# Altium schematic sheet Sheet1.SchDoc
size A4
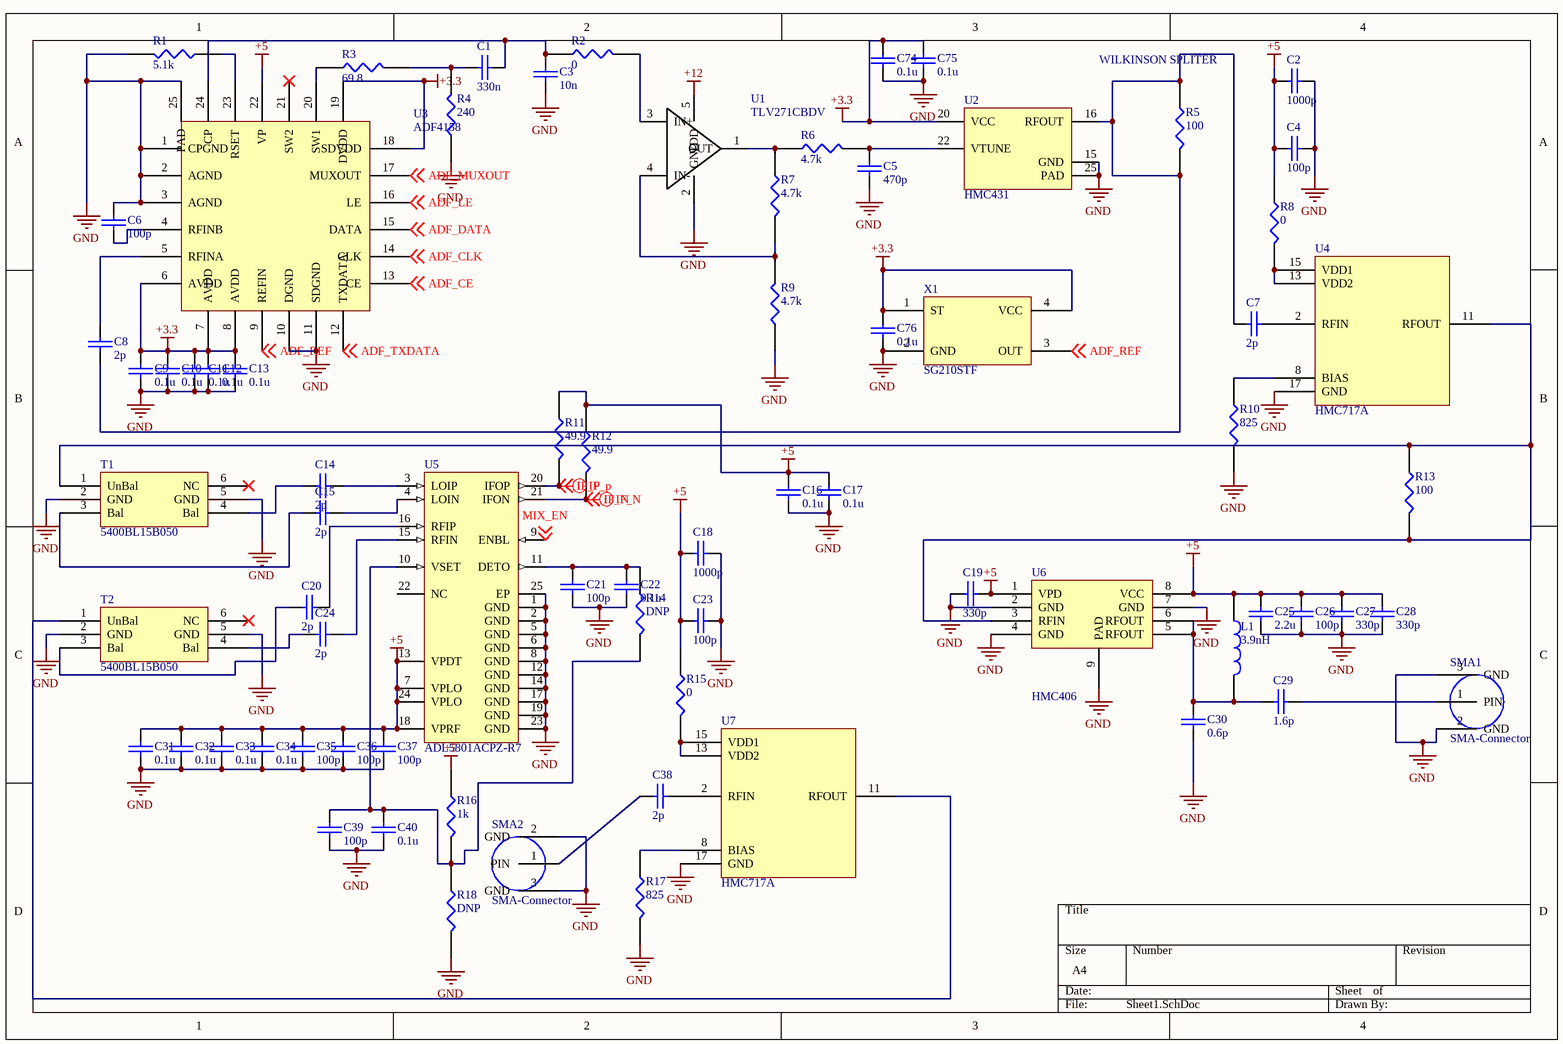
[diagram p0: Sheet1.SchDoc]

## Parts
C1  330n  [0603_R]
C2  1000p  [0603_R]
C3  10n  [0603_R]
C4  100p  [0603_R]
C5  470p  [0603_R]
C6  100p  [0603_R]
C7  2p  [0603_R]
C8  2p  [0603_R]
C9  0.1u  [0603_R]
C10  0.1u  [0603_R]
C11  0.1u  [0603_R]
C12  0.1u  [0603_R]
C13  0.1u  [0603_R]
C14  2p  [0603_R]
C15  2p  [0603_R]
C16  0.1u  [0603_R]
C17  0.1u  [0603_R]
C18  1000p  [0603_R]
C19  330p  [0603_R]
C20  2p  [0603_R]
C21  100p  [0603_R]
C22  0.1u  [0603_R]
C23  100p  [0603_R]
C24  2p  [0603_R]
C25  2.2u  [0603_R]
C26  100p  [0603_R]
C27  330p  [0603_R]
C28  330p  [0603_R]
C29  1.6p  [0603_R]
C30  0.6p  [0603_R]
C31  0.1u  [0603_R]
C32  0.1u  [0603_R]
C33  0.1u  [0603_R]
C34  0.1u  [0603_R]
C35  100p  [0603_R]
C36  100p  [0603_R]
C37  100p  [0603_R]
C38  2p  [0603_R]
C39  100p  [0603_R]
C40  0.1u  [0603_R]
C74  0.1u  [0603_R]
C75  0.1u  [0603_R]
C76  0.1u  [0603_R]
L1  3.9nH  [0603_R]
R1  5.1k  [0603_R]
R2  0  [0603_R]
R3  69.8  [0603_R]
R4  240  [0603_R]
R5  100  [0603_R]
R6  4.7k  [0603_R]
R7  4.7k  [0603_R]
R8  0  [0603_R]
R9  4.7k  [0603_R]
R10  825  [0603_R]
R11  49.9  [0603_R]
R12  49.9  [0603_R]
R13  100  [0603_R]
R14  DNP  [0603_R]
R15  0  [0603_R]
R16  1k  [0603_R]
R17  825  [0603_R]
R18  DNP  [0603_R]
SMA1  SMA-Connector  [SMA-2]
SMA2  SMA-Connector  [SMA-2]
T1  5400BL15B050  [0603-6]
T2  5400BL15B050  [0603-6]
U1  TLV271CBDV  [LT-S5-5-TSOT-23_L]
U2  HMC431  [LCC24-HMC431]
U3  ADF4158  [LCC24_ADF4158]
U4  HMC717A  [LCC16-717A]
U5  ADL5801ACPZ-R7  [ADI-CP-24-3_N]
U6  HMC406
U7  HMC717A  [LCC16-717A]
X1  SG210STF  [SG210STF]

## Nets
+3.3: C9.1 C10.1 C11.1 C12.1 C13.1 C74.2 C75.2 C76.1 U2.20(VCC) U3.6(AVDD) U3.7(AVDD) U3.8(AVDD) U3.18(SDVDD) U3.19(DVDD) X1.1(ST) X1.4(VCC)
+5: C2.1 C4.1 C16.2 C17.2 C18.1 C19.1 C23.1 C25.2 C26.2 C27.2 C28.2 C31.2 C32.2 C33.2 C34.2 C35.2 C36.2 C37.2 L1.1 R8.1 R11.1 R12.1 R15.1 R16.1 U3.22(VP) U5.7(VPLO) U5.13(VPDT) U5.18(VPRF) U5.24(VPLO) U6.1(VPD) U6.8(VCC)
+12: U1.5(VDD)
GND: C2.2 C3.2 C4.2 C5.2 C6.1 C9.2 C10.2 C11.2 C12.2 C13.2 C16.1 C17.1 C18.2 C19.2 C21.1 C22.1 C23.2 C25.1 C26.1 C27.1 C28.1 C30.1 C31.1 C32.1 C33.1 C34.1 C35.1 C36.1 C37.1 C39.1 C40.1 C74.1 C75.1 C76.2 R1.2 R4.1 R9.1 R10.2 R17.2 R18.2 SMA1.2(GND) SMA1.3(GND) SMA2.2(GND) SMA2.3(GND) T1.2(GND) T1.5(GND) T2.2(GND) T2.5(GND) U1.2(GND) U2.15(GND) U2.25(PAD) U3.1(CPGND) U3.2(AGND) U3.3(AGND) U3.10(DGND) U3.11(SDGND) U3.25(PAD) U4.17(GND) U5.1(GND) U5.2(GND) U5.5(GND) U5.6(GND) U5.8(GND) U5.12(GND) U5.14(GND) U5.17(GND) U5.19(GND) U5.23(GND) U5.25(EP) U6.2(GND) U6.4(GND) U6.7(GND) U6.9(PAD) U7.17(GND) X1.2(GND)
ADF_CE: U3.13(CE) ; off-sheet ADF_CE
ADF_CLK: U3.14(CLK) ; off-sheet ADF_CLK
ADF_DATA: U3.15(DATA) ; off-sheet ADF_DATA
ADF_LE: U3.16(LE) ; off-sheet ADF_LE
ADF_MUXOUT: U3.17(MUXOUT) ; off-sheet ADF_MUXOUT
ADF_REF: U3.9(REFIN) X1.3(OUT) ; off-sheet ADF_REF
ADF_TXDATA: U3.12(TXDATA) ; off-sheet ADF_TXDATA
IF_N: R12.2 U5.21(IFON) ; off-sheet IF_N
IF_P: R11.2 U5.20(IFOP) ; off-sheet IF_P
MIX_EN: U5.9(ENBL) ; off-sheet MIX_EN
NetC1_1: C1.1 R3.2 R4.2
NetC1_2: C1.2 C3.1 R2.1 U3.24(CP)
NetC5_1: C5.1 R6.2 U2.22(VTUNE)
NetC6_2: C6.2 U3.4(RFINB)
NetC7_1: C7.1 C8.2 R5.1 R5.2 U2.16(RFOUT)
NetC7_2: C7.2 U4.2(RFIN)
NetC8_1: C8.1 U3.5(RFINA)
NetC14_1: C14.1 T1.4(Bal)
NetC14_2: C14.2 U5.3(LOIP)
NetC15_1: C15.1 T1.3(Bal)
NetC15_2: C15.2 U5.4(LOIN)
NetC20_1: C20.1 T2.3(Bal)
NetC20_2: C20.2 U5.16(RFIP)
NetC21_2: C21.2 C22.2 R14.1 U5.11(DETO)
NetC24_1: C24.1 T2.4(Bal)
NetC24_2: C24.2 U5.15(RFIN)
NetC29_1: C29.1 SMA1.1(PIN)
NetC29_2: C29.2 C30.2 L1.2 U6.5(RFOUT) U6.6(RFOUT)
NetC38_1: C38.1 SMA2.1(PIN)
NetC38_2: C38.2 U7.2(RFIN)
NetC39_2: C39.2 C40.2 R14.2 R16.2 R18.1 U5.10(VSET)
NetR1_1: R1.1 U3.23(RSET)
NetR2_2: R2.2 U1.3(IN+)
NetR3_1: R3.1 U3.20(SW1)
NetR6_1: R6.1 R7.1 U1.1(OUT)
NetR7_2: R7.2 R9.2 U1.4(IN-)
NetR8_2: R8.2 U4.13(VDD2) U4.15(VDD1)
NetR10_1: R10.1 U4.8(BIAS)
NetR13_1: R13.1 R13.2 T1.1(UnBal) U4.11(RFOUT) U6.3(RFIN)
NetR15_2: R15.2 U7.13(VDD2) U7.15(VDD1)
NetR17_1: R17.1 U7.8(BIAS)
NetT2_1: T2.1(UnBal) U7.11(RFOUT)

Not connected (* = marked no-connect by the designer): T1 6(NC)*; T2 6(NC)*; U3 21(SW2)*; U5 22(NC)

## Layout directives
differential pair: IF_N, IF_P

## Notes on the sheet
- WILKINSON SPLITER

## Library data of the parts
C1-C40 C74-C76 = CAP: Capacitor
L1 = INDUCTOR
R1-R18 = RES1
U3 = ADF4518
U5 = ADL5801ACPZ-R7: High IP3, 10 MHz to 6 GHz, Active Mixer, 130mA Supply Current, CP-24-3, Pb-Free, 1500 Reel; RF Frequency (MHZ): 10 to 6000; IF Frequency (MHz): LF to 3000; Conversion Gain (dB): 1.8dB; IP3 (dBm): 28.5; P1dB (dBm): 13.3; NF (dB): 9.75dB; DatasheetVersion: Rev. A; PackageVersion: Jan-2005; PackageReference: CP-24-3; PackageDescription: 24-Lead Lead Frame Chip Scale Package [LFCSP_VQ]; LO Frequency (MHz): 10 to 6000; Code_JEDEC: MO-220-VGGD-8; ComponentLink1Description: Manufacturer URL; ComponentLink1URL: www.analog.com; ComponentLink2Description: Datasheet; ComponentLink2URL: http://www.analog.com/static/imported-files/data_sheets/ADL5801.pdf; ComponentLink3Description: Package Specification; ComponentLink3URL: http://www.analog.com/static/imported-files/packages/56702234806764CP_24_3.pdf